# Altium schematic sheet LMS7002M.SchDoc: LMS7002M Sheet Symbol Connections
size A3; Author: NeoExiZ; CompanyName: BUPT CPS Lab; Engineer: NeoExiZ; Organization: NeoExiZ; Address1: 418, 4#Building,BUPT; Address2: No.10, Xitucheng Road; Address3: Beijing; Address4: China
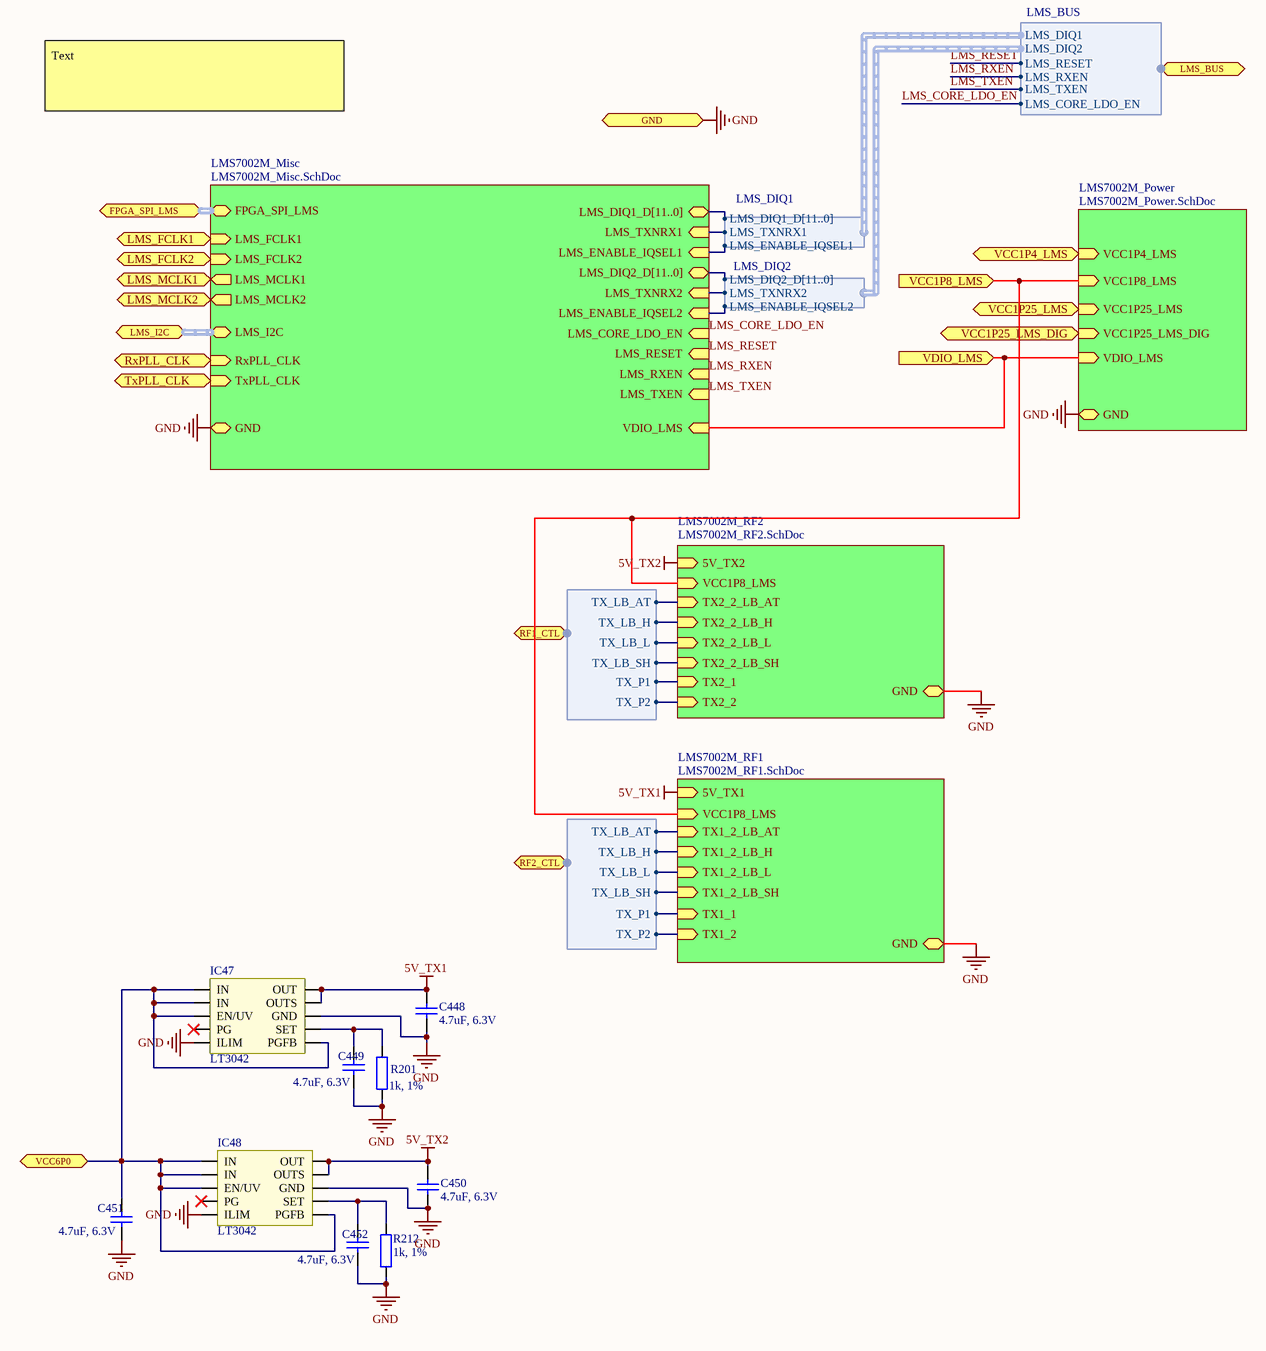
[diagram p0: LMS7002M.SchDoc]

## Parts
C448  4.7uF, 6.3V  [CAP0402]
C449  4.7uF, 6.3V  [CAP0402]
C450  4.7uF, 6.3V  [CAP0402]
C451  4.7uF, 6.3V  [CAP0402]
C452  4.7uF, 6.3V  [CAP0402]
IC47  LT3042  [SOP-10]
IC48  LT3042  [SOP-10]
R201  1k, 1%  [RES0402]
R212  1k, 1%  [RES0402]

## Sub-sheets
LMS7002M_Misc = LMS7002M_Misc.SchDoc: FPGA_SPI_LMS (harness FPGA_SPI_LMS), LMS_FCLK1 (in), LMS_FCLK2 (in), LMS_MCLK1 (out), LMS_MCLK2 (out), RxPLL_CLK (in), TxPLL_CLK (in), LMS_DIQ2_D[11..0] (bidir), LMS_DIQ1_D[11..0] (bidir), LMS_ENABLE_IQSEL1 (in), LMS_ENABLE_IQSEL2 (in), LMS_TXNRX1 (in), LMS_TXNRX2 (in), LMS_CORE_LDO_EN (in), LMS_RESET (in), LMS_RXEN (in), LMS_TXEN (in), VDIO_LMS (in), GND, LMS_I2C (harness I2C)
LMS7002M_Power = LMS7002M_Power.SchDoc: VCC1P4_LMS (in), VCC1P8_LMS (in), VCC1P25_LMS (in), VCC1P25_LMS_DIG (in), VDIO_LMS (in), GND
LMS7002M_RF1 = LMS7002M_RF1.SchDoc: TX1_2_LB_AT (in), TX1_2_LB_H (in), TX1_2_LB_L (in), TX1_2_LB_SH (in), VCC1P8_LMS (in), GND, TX1_2 (in), TX1_1 (in), 5V_TX1 (in)
LMS7002M_RF2 = LMS7002M_RF2.SchDoc: TX2_2_LB_SH (in), TX2_2_LB_L (in), TX2_2_LB_H (in), TX2_2_LB_AT (in), VCC1P8_LMS (in), GND, TX2_1 (in), TX2_2 (in), 5V_TX2 (in)

## Ports
FPGA_SPI_LMS (harness FPGA_SPI_LMS), GND, LMS_BUS (harness LMS_BUS), LMS_FCLK1 (in), LMS_FCLK2 (in), LMS_I2C (harness I2C), LMS_MCLK1 (out), LMS_MCLK2 (out), RF1_CTL (harness RF_CTL), RF2_CTL (harness RF_CTL), RxPLL_CLK (in), TxPLL_CLK (in), VCC1P4_LMS (in), VCC1P8_LMS (in), VCC1P25_LMS (in), VCC1P25_LMS_DIG (in), VCC6P0, VDIO_LMS (in)

## Harnesses
LMS_BUS: LMS_DIQ1, LMS_DIQ2, LMS_RESET, LMS_RXEN, LMS_TXEN, LMS_CORE_LDO_EN
LMS_DIQ1: LMS_DIQ1_D[11..0], LMS_TXNRX1, LMS_ENABLE_IQSEL1
LMS_DIQ2: LMS_DIQ2_D[11..0], LMS_TXNRX2, LMS_ENABLE_IQSEL2
RF_CTL: TX_LB_AT, TX_LB_H, TX_LB_L, TX_LB_SH, TX_P1, TX_P2

## Nets
5V_TX1: C448.2 IC47.9(OUTS) IC47.10(OUT) ; sheet LMS7002M_RF1/5V_TX1
5V_TX2: C450.2 IC48.9(OUTS) IC48.10(OUT) ; sheet LMS7002M_RF2/5V_TX2
GND: C448.1 C449.1 C450.1 C451.1 C452.1 IC47.5(ILIM) IC47.8(GND) IC48.5(ILIM) IC48.8(GND) R201.1 R212.1 ; port GND, sheet LMS7002M_Misc/GND, sheet LMS7002M_Power/GND, sheet LMS7002M_RF1/GND, sheet LMS7002M_RF2/GND
LMS_CORE_LDO_EN: sheet LMS7002M_Misc/LMS_CORE_LDO_EN, port LMS_BUS.LMS_CORE_LDO_EN
LMS_FCLK1: port LMS_FCLK1, sheet LMS7002M_Misc/LMS_FCLK1
LMS_FCLK2: port LMS_FCLK2, sheet LMS7002M_Misc/LMS_FCLK2
LMS_MCLK1: port LMS_MCLK1, sheet LMS7002M_Misc/LMS_MCLK1
LMS_MCLK2: port LMS_MCLK2, sheet LMS7002M_Misc/LMS_MCLK2
LMS_RESET: sheet LMS7002M_Misc/LMS_RESET, port LMS_BUS.LMS_RESET
LMS_RXEN: sheet LMS7002M_Misc/LMS_RXEN, port LMS_BUS.LMS_RXEN
LMS_TXEN: sheet LMS7002M_Misc/LMS_TXEN, port LMS_BUS.LMS_TXEN
RxPLL_CLK: port RxPLL_CLK, sheet LMS7002M_Misc/RxPLL_CLK
TxPLL_CLK: port TxPLL_CLK, sheet LMS7002M_Misc/TxPLL_CLK
VCC1P4_LMS: port VCC1P4_LMS, sheet LMS7002M_Power/VCC1P4_LMS
VCC1P8_LMS: port VCC1P8_LMS, sheet LMS7002M_Power/VCC1P8_LMS, sheet LMS7002M_RF1/VCC1P8_LMS, sheet LMS7002M_RF2/VCC1P8_LMS
VCC1P25_LMS: port VCC1P25_LMS, sheet LMS7002M_Power/VCC1P25_LMS
VCC1P25_LMS_DIG: port VCC1P25_LMS_DIG, sheet LMS7002M_Power/VCC1P25_LMS_DIG
VCC6P0: C451.2 IC47.1(IN) IC47.2(IN) IC47.3(EN/UV) IC47.6(PGFB) IC48.1(IN) IC48.2(IN) IC48.3(EN/UV) IC48.6(PGFB) ; port VCC6P0
VDIO_LMS: port VDIO_LMS, sheet LMS7002M_Misc/VDIO_LMS, sheet LMS7002M_Power/VDIO_LMS
NetC449_2: C449.2 IC47.7(SET) R201.2
NetC452_2: C452.2 IC48.7(SET) R212.2
(unnamed): sheet LMS7002M_Misc/LMS_ENABLE_IQSEL1, harness LMS_DIQ1.LMS_ENABLE_IQSEL1
(unnamed): sheet LMS7002M_Misc/LMS_ENABLE_IQSEL2, harness LMS_DIQ2.LMS_ENABLE_IQSEL2
(unnamed): sheet LMS7002M_Misc/LMS_TXNRX1, harness LMS_DIQ1.LMS_TXNRX1
(unnamed): sheet LMS7002M_Misc/LMS_TXNRX2, harness LMS_DIQ2.LMS_TXNRX2
(unnamed): sheet LMS7002M_RF1/TX1_2_LB_AT, port RF2_CTL.TX_LB_AT
(unnamed): sheet LMS7002M_RF1/TX1_2_LB_H, port RF2_CTL.TX_LB_H
(unnamed): sheet LMS7002M_RF1/TX1_2_LB_L, port RF2_CTL.TX_LB_L
(unnamed): sheet LMS7002M_RF1/TX1_2_LB_SH, port RF2_CTL.TX_LB_SH
(unnamed): sheet LMS7002M_RF1/TX1_2, port RF2_CTL.TX_P2
(unnamed): sheet LMS7002M_RF1/TX1_1, port RF2_CTL.TX_P1
(unnamed): sheet LMS7002M_RF2/TX2_2_LB_SH, port RF1_CTL.TX_LB_SH
(unnamed): sheet LMS7002M_RF2/TX2_2_LB_L, port RF1_CTL.TX_LB_L
(unnamed): sheet LMS7002M_RF2/TX2_2_LB_H, port RF1_CTL.TX_LB_H
(unnamed): sheet LMS7002M_RF2/TX2_2_LB_AT, port RF1_CTL.TX_LB_AT
(unnamed): sheet LMS7002M_RF2/TX2_1, port RF1_CTL.TX_P1
(unnamed): sheet LMS7002M_RF2/TX2_2, port RF1_CTL.TX_P2

Not connected (* = marked no-connect by the designer): IC47 4(PG)*; IC48 4(PG)*

## Buses and harness runs
harness port FPGA_SPI_LMS = sheet LMS7002M_Misc/FPGA_SPI_LMS
harness port LMS_I2C = sheet LMS7002M_Misc/LMS_I2C

## Notes on the sheet
- Text
- Note:
- Project Name:
- Size:
- Date:
- Title:
- A3
- Revision:
- Time:
- Author:
- Sheet
- of
- File:

## Library data of the parts
C448-C452 = Cap_0402: Manufacturer: Murata Electronics North America; Manufacturer Part Number: GRM155R60J475ME87D; Part Description: 4.7µF ±20% 6.3V X5R Ceramic Capacitor -55°C ~ 85°C Surface Mount, MLCC 0402 (1005 Metric) 0.039" L x 0.020" W (1.00mm x 0.50mm); Tolerance: ±20%; Capacitance: 4.7µF; Temperature Coefficient: X5R; Lead Style: -; Ratings: -; Height - Seated (Max): -; Thickness (Max): 0.022" (0.55mm); Voltage - Rated: 6.3V; Packaging: Cut Tape (CT); Lead Spacing: -; Category: Capacitors; Supplier Part Number 1: 490-5408-1-ND; Applications: General Purpose; Operating Temperature: -55°C ~ 85°C; Mounting Type: Surface Mount, MLCC; Features: Derating Recommended; RoHS: RoHS Compliant; Supplier 1: Digi-Key; Package / Case: 0402 (1005 Metric); Size / Dimension: 0.039" L x 0.020" W (1.00mm x 0.50mm); Value: 4.7uF, 6.3V
R201 R212 = Res_0402: Manufacturer: Stackpole Electronics Inc; Manufacturer Part Number 1: RMCF0402FT1K00; Part Description: RES SMD 1K OHM 1% 1/16W 0402; Temperature Coefficient: ±100ppm/°C; Power (Watts): 0.063W, 1/16W; Value: 1k, 1%; Supplier 1: Digi-Key; Supplier Part Number 1: RMCF0402FT1K00TR-ND; Resistance (Ohms): 1k; Packaging: Tape & Reel (TR); Category: Resistors; RoHS: RoHS Compliant; Tolerance: ±1%; Height: 0.016" (0.40mm); Number of Terminations: 2; Package / Case: 0402 (1005 Metric); Operating Temperature: -55°C ~ 155°C; Features: -; Composition: Thick Film; Supplier Device Package: 0402; Size / Dimension: 0.039" L x 0.020" W (1.00mm x 0.50mm)